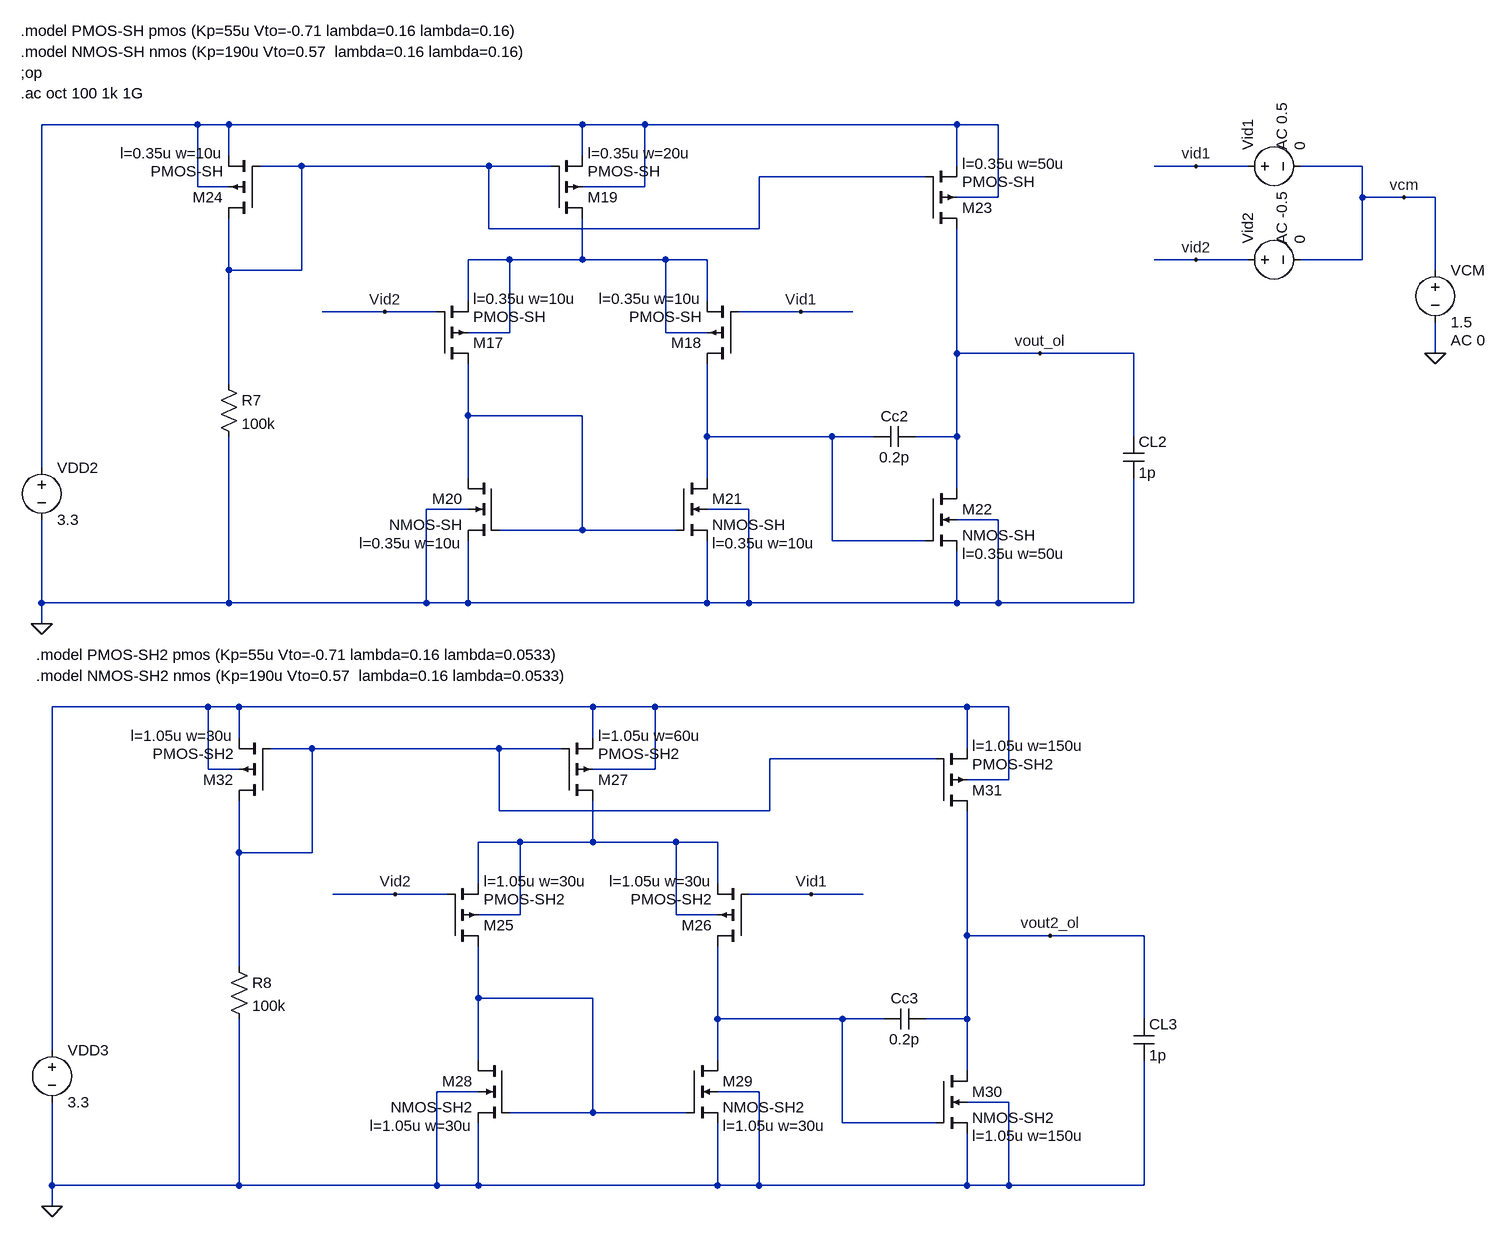
[diagram p0: schematic 3_pmos_opamp_miller_2L.asc]
3_pmos_opamp_miller_2L.asc, the LTspice schematic file:
Version 4
SHEET 1 1924 2100
WIRE -2912 96 -3152 96
WIRE -2864 96 -2912 96
WIRE -2320 96 -2864 96
WIRE -2224 96 -2320 96
WIRE -1744 96 -2224 96
WIRE -1680 96 -1744 96
WIRE -2864 144 -2864 96
WIRE -2320 144 -2320 96
WIRE -2752 160 -2816 160
WIRE -2464 160 -2752 160
WIRE -2368 160 -2464 160
WIRE -1744 160 -1744 96
WIRE -1376 160 -1440 160
WIRE -1296 160 -1376 160
WIRE -1120 160 -1216 160
WIRE -1792 176 -2048 176
WIRE -2912 192 -2912 96
WIRE -2864 192 -2912 192
WIRE -2224 192 -2224 96
WIRE -2224 192 -2320 192
WIRE -1680 208 -1680 96
WIRE -1680 208 -1744 208
WIRE -1120 208 -1120 160
WIRE -1056 208 -1120 208
WIRE -1008 208 -1056 208
WIRE -2464 256 -2464 160
WIRE -2048 256 -2048 176
WIRE -2048 256 -2464 256
WIRE -2432 304 -2496 304
WIRE -2320 304 -2320 240
WIRE -2320 304 -2432 304
WIRE -2192 304 -2320 304
WIRE -2128 304 -2192 304
WIRE -1376 304 -1440 304
WIRE -1296 304 -1376 304
WIRE -1120 304 -1120 208
WIRE -1120 304 -1216 304
WIRE -2864 320 -2864 240
WIRE -2752 320 -2752 160
WIRE -2752 320 -2864 320
WIRE -1008 320 -1008 208
WIRE -2496 368 -2496 304
WIRE -2128 368 -2128 304
WIRE -2624 384 -2720 384
WIRE -2544 384 -2624 384
WIRE -1984 384 -2080 384
WIRE -1904 384 -1984 384
WIRE -2432 416 -2432 304
WIRE -2432 416 -2496 416
WIRE -2192 416 -2192 304
WIRE -2128 416 -2192 416
WIRE -1744 448 -1744 256
WIRE -1616 448 -1744 448
WIRE -1472 448 -1616 448
WIRE -1008 448 -1008 400
WIRE -2864 496 -2864 320
WIRE -2496 544 -2496 464
WIRE -2320 544 -2496 544
WIRE -2128 576 -2128 464
WIRE -1936 576 -2128 576
WIRE -1872 576 -1936 576
WIRE -1744 576 -1744 448
WIRE -1744 576 -1808 576
WIRE -1472 576 -1472 448
WIRE -3152 624 -3152 96
WIRE -2496 640 -2496 544
WIRE -2128 640 -2128 576
WIRE -1744 656 -1744 576
WIRE -2496 688 -2560 688
WIRE -2064 688 -2128 688
WIRE -1680 704 -1744 704
WIRE -2320 720 -2320 544
WIRE -2320 720 -2448 720
WIRE -2176 720 -2320 720
WIRE -1936 736 -1936 576
WIRE -1792 736 -1936 736
WIRE -3152 832 -3152 704
WIRE -2864 832 -2864 576
WIRE -2864 832 -3152 832
WIRE -2560 832 -2560 688
WIRE -2560 832 -2864 832
WIRE -2496 832 -2496 736
WIRE -2496 832 -2560 832
WIRE -2128 832 -2128 736
WIRE -2128 832 -2496 832
WIRE -2064 832 -2064 688
WIRE -2064 832 -2128 832
WIRE -1744 832 -1744 752
WIRE -1744 832 -2064 832
WIRE -1680 832 -1680 704
WIRE -1680 832 -1744 832
WIRE -1472 832 -1472 640
WIRE -1472 832 -1680 832
WIRE -3152 864 -3152 832
WIRE -2896 992 -3136 992
WIRE -2848 992 -2896 992
WIRE -2304 992 -2848 992
WIRE -2208 992 -2304 992
WIRE -1728 992 -2208 992
WIRE -1664 992 -1728 992
WIRE -2848 1040 -2848 992
WIRE -2304 1040 -2304 992
WIRE -2736 1056 -2800 1056
WIRE -2448 1056 -2736 1056
WIRE -2352 1056 -2448 1056
WIRE -1728 1056 -1728 992
WIRE -1776 1072 -2032 1072
WIRE -2896 1088 -2896 992
WIRE -2848 1088 -2896 1088
WIRE -2208 1088 -2208 992
WIRE -2208 1088 -2304 1088
WIRE -1664 1104 -1664 992
WIRE -1664 1104 -1728 1104
WIRE -2448 1152 -2448 1056
WIRE -2032 1152 -2032 1072
WIRE -2032 1152 -2448 1152
WIRE -2416 1200 -2480 1200
WIRE -2304 1200 -2304 1136
WIRE -2304 1200 -2416 1200
WIRE -2176 1200 -2304 1200
WIRE -2112 1200 -2176 1200
WIRE -2848 1216 -2848 1136
WIRE -2736 1216 -2736 1056
WIRE -2736 1216 -2848 1216
WIRE -2480 1264 -2480 1200
WIRE -2112 1264 -2112 1200
WIRE -2608 1280 -2704 1280
WIRE -2528 1280 -2608 1280
WIRE -1968 1280 -2064 1280
WIRE -1888 1280 -1968 1280
WIRE -2416 1312 -2416 1200
WIRE -2416 1312 -2480 1312
WIRE -2176 1312 -2176 1200
WIRE -2112 1312 -2176 1312
WIRE -1728 1344 -1728 1152
WIRE -1600 1344 -1728 1344
WIRE -1456 1344 -1600 1344
WIRE -2848 1392 -2848 1216
WIRE -2480 1440 -2480 1360
WIRE -2304 1440 -2480 1440
WIRE -2112 1472 -2112 1360
WIRE -1920 1472 -2112 1472
WIRE -1856 1472 -1920 1472
WIRE -1728 1472 -1728 1344
WIRE -1728 1472 -1792 1472
WIRE -1456 1472 -1456 1344
WIRE -3136 1520 -3136 992
WIRE -2480 1536 -2480 1440
WIRE -2112 1536 -2112 1472
WIRE -1728 1552 -1728 1472
WIRE -2480 1584 -2544 1584
WIRE -2048 1584 -2112 1584
WIRE -1664 1600 -1728 1600
WIRE -2304 1616 -2304 1440
WIRE -2304 1616 -2432 1616
WIRE -2160 1616 -2304 1616
WIRE -1920 1632 -1920 1472
WIRE -1776 1632 -1920 1632
WIRE -3136 1728 -3136 1600
WIRE -2848 1728 -2848 1472
WIRE -2848 1728 -3136 1728
WIRE -2544 1728 -2544 1584
WIRE -2544 1728 -2848 1728
WIRE -2480 1728 -2480 1632
WIRE -2480 1728 -2544 1728
WIRE -2112 1728 -2112 1632
WIRE -2112 1728 -2480 1728
WIRE -2048 1728 -2048 1584
WIRE -2048 1728 -2112 1728
WIRE -1728 1728 -1728 1648
WIRE -1728 1728 -2048 1728
WIRE -1664 1728 -1664 1600
WIRE -1664 1728 -1728 1728
WIRE -1456 1728 -1456 1536
WIRE -1456 1728 -1664 1728
WIRE -3136 1760 -3136 1728
FLAG -1008 448 0
FLAG -1376 160 vid1
FLAG -1376 304 vid2
FLAG -1056 208 vcm
FLAG -3152 864 0
FLAG -1984 384 Vid1
FLAG -2624 384 Vid2
FLAG -1616 448 vout_ol
FLAG -3136 1760 0
FLAG -1968 1280 Vid1
FLAG -2608 1280 Vid2
FLAG -1600 1344 vout2_ol
SYMBOL voltage -1008 304 R0
WINDOW 123 24 124 Left 2
WINDOW 39 0 0 Left 2
SYMATTR Value2 AC 0
SYMATTR InstName VCM
SYMATTR Value 1.5
SYMBOL voltage -1312 160 R270
WINDOW 123 24 68 Left 2
WINDOW 39 0 0 Left 2
SYMATTR Value2 AC 0.5
SYMATTR InstName Vid1
SYMATTR Value 0
SYMBOL voltage -1312 304 R270
WINDOW 123 24 68 Left 2
WINDOW 39 0 0 Left 2
SYMATTR Value2 AC -0.5
SYMATTR InstName Vid2
SYMATTR Value 0
SYMBOL voltage -3152 608 R0
WINDOW 123 0 0 Left 2
WINDOW 39 0 0 Left 2
SYMATTR InstName VDD2
SYMATTR Value 3.3
SYMBOL cap -1488 576 R0
SYMATTR InstName CL2
SYMATTR Value 1p
SYMBOL pmos4 -2544 464 M180
WINDOW 123 56 100 Left 2
SYMATTR Value2 l=0.35u w=10u
SYMATTR InstName M17
SYMATTR Value PMOS-SH
SYMBOL pmos4 -2080 464 R180
WINDOW 123 56 100 Left 2
SYMATTR Value2 l=0.35u w=10u
SYMATTR InstName M18
SYMATTR Value PMOS-SH
SYMBOL pmos4 -2368 240 M180
WINDOW 123 56 100 Left 2
SYMATTR Value2 l=0.35u w=20u
SYMATTR InstName M19
SYMATTR Value PMOS-SH
SYMBOL nmos4 -2448 640 M0
WINDOW 123 56 100 Left 2
SYMATTR Value2 l=0.35u w=10u
SYMATTR InstName M20
SYMATTR Value NMOS-SH
SYMBOL nmos4 -2176 640 R0
WINDOW 123 56 100 Left 2
SYMATTR Value2 l=0.35u w=10u
SYMATTR InstName M21
SYMATTR Value NMOS-SH
SYMBOL nmos4 -1792 656 R0
WINDOW 123 56 100 Left 2
SYMATTR Value2 l=0.35u w=50u
SYMATTR InstName M22
SYMATTR Value NMOS-SH
SYMBOL pmos4 -1792 256 M180
WINDOW 123 56 100 Left 2
SYMATTR Value2 l=0.35u w=50u
SYMATTR InstName M23
SYMATTR Value PMOS-SH
SYMBOL pmos4 -2816 240 R180
WINDOW 123 56 100 Left 2
SYMATTR Value2 l=0.35u w=10u
SYMATTR InstName M24
SYMATTR Value PMOS-SH
SYMBOL cap -1872 592 R270
WINDOW 0 32 32 VTop 2
WINDOW 3 0 32 VBottom 2
SYMATTR InstName Cc2
SYMATTR Value 0.2p
SYMBOL res -2880 480 R0
SYMATTR InstName R7
SYMATTR Value 100k
SYMBOL voltage -3136 1504 R0
WINDOW 123 0 0 Left 2
WINDOW 39 0 0 Left 2
SYMATTR InstName VDD3
SYMATTR Value 3.3
SYMBOL cap -1472 1472 R0
SYMATTR InstName CL3
SYMATTR Value 1p
SYMBOL pmos4 -2528 1360 M180
WINDOW 123 56 100 Left 2
SYMATTR Value2 l=1.05u w=30u
SYMATTR InstName M25
SYMATTR Value PMOS-SH2
SYMBOL pmos4 -2064 1360 R180
WINDOW 123 56 100 Left 2
SYMATTR Value2 l=1.05u w=30u
SYMATTR InstName M26
SYMATTR Value PMOS-SH2
SYMBOL pmos4 -2352 1136 M180
WINDOW 123 56 100 Left 2
SYMATTR Value2 l=1.05u w=60u
SYMATTR InstName M27
SYMATTR Value PMOS-SH2
SYMBOL nmos4 -2432 1536 M0
WINDOW 123 56 100 Left 2
SYMATTR Value2 l=1.05u w=30u
SYMATTR InstName M28
SYMATTR Value NMOS-SH2
SYMBOL nmos4 -2160 1536 R0
WINDOW 123 56 100 Left 2
SYMATTR Value2 l=1.05u w=30u
SYMATTR InstName M29
SYMATTR Value NMOS-SH2
SYMBOL nmos4 -1776 1552 R0
WINDOW 123 56 100 Left 2
SYMATTR Value2 l=1.05u w=150u
SYMATTR InstName M30
SYMATTR Value NMOS-SH2
SYMBOL pmos4 -1776 1152 M180
WINDOW 123 56 100 Left 2
SYMATTR Value2 l=1.05u w=150u
SYMATTR InstName M31
SYMATTR Value PMOS-SH2
SYMBOL pmos4 -2800 1136 R180
WINDOW 123 56 100 Left 2
SYMATTR Value2 l=1.05u w=30u
SYMATTR InstName M32
SYMATTR Value PMOS-SH2
SYMBOL cap -1856 1488 R270
WINDOW 0 32 32 VTop 2
WINDOW 3 0 32 VBottom 2
SYMATTR InstName Cc3
SYMATTR Value 0.2p
SYMBOL res -2864 1376 R0
SYMATTR InstName R8
SYMATTR Value 100k
TEXT -3184 -16 Left 2 !.model NMOS-SH nmos (Kp=190u Vto=0.57  lambda=0.16 lambda=0.16)
TEXT -3184 16 Left 2 !;op
TEXT -3184 48 Left 2 !.ac oct 100 1k 1G
TEXT -3184 -48 Left 2 !.model PMOS-SH pmos (Kp=55u Vto=-0.71 lambda=0.16 lambda=0.16)
TEXT -3160 944 Left 2 !.model NMOS-SH2 nmos (Kp=190u Vto=0.57  lambda=0.16 lambda=0.0533)
TEXT -3160 912 Left 2 !.model PMOS-SH2 pmos (Kp=55u Vto=-0.71 lambda=0.16 lambda=0.0533)

The netlist it stands for:
* 3_pmos_opamp_miller_2L.asc
VCM vcm 0 1.5 AC 0
Vid1 vid1 vcm 0 AC 0.5
Vid2 vid2 vcm 0 AC -0.5
VDD2 N001 0 3.3
CL2 vout_ol 0 1p
M17 N004 vid2 N003 N003 PMOS-SH l=0.35u w=10u
M18 N005 vid1 N003 N003 PMOS-SH l=0.35u w=10u
M19 N003 N002 N001 N001 PMOS-SH l=0.35u w=20u
M20 N004 N004 0 0 NMOS-SH l=0.35u w=10u
M21 N005 N004 0 0 NMOS-SH l=0.35u w=10u
M22 vout_ol N005 0 0 NMOS-SH l=0.35u w=50u
M23 vout_ol N002 N001 N001 PMOS-SH l=0.35u w=50u
M24 N002 N002 N001 N001 PMOS-SH l=0.35u w=10u
Cc2 N005 vout_ol 0.2p
R7 N002 0 100k
VDD3 N006 0 3.3
CL3 vout2_ol 0 1p
M25 N009 vid2 N008 N008 PMOS-SH2 l=1.05u w=30u
M26 N010 vid1 N008 N008 PMOS-SH2 l=1.05u w=30u
M27 N008 N007 N006 N006 PMOS-SH2 l=1.05u w=60u
M28 N009 N009 0 0 NMOS-SH2 l=1.05u w=30u
M29 N010 N009 0 0 NMOS-SH2 l=1.05u w=30u
M30 vout2_ol N010 0 0 NMOS-SH2 l=1.05u w=150u
M31 vout2_ol N007 N006 N006 PMOS-SH2 l=1.05u w=150u
M32 N007 N007 N006 N006 PMOS-SH2 l=1.05u w=30u
Cc3 N010 vout2_ol 0.2p
R8 N007 0 100k
.model NMOS NMOS
.model PMOS PMOS
.lib standard.mos
.model NMOS-SH nmos (Kp=190u Vto=0.57  lambda=0.16 lambda=0.16)
;op
.ac oct 100 1k 1G
.model PMOS-SH pmos (Kp=55u Vto=-0.71 lambda=0.16 lambda=0.16)
.model NMOS-SH2 nmos (Kp=190u Vto=0.57  lambda=0.16 lambda=0.0533)
.model PMOS-SH2 pmos (Kp=55u Vto=-0.71 lambda=0.16 lambda=0.0533)
.backanno
.end